# EAGLE design power_converter (EAGLE 6.4)
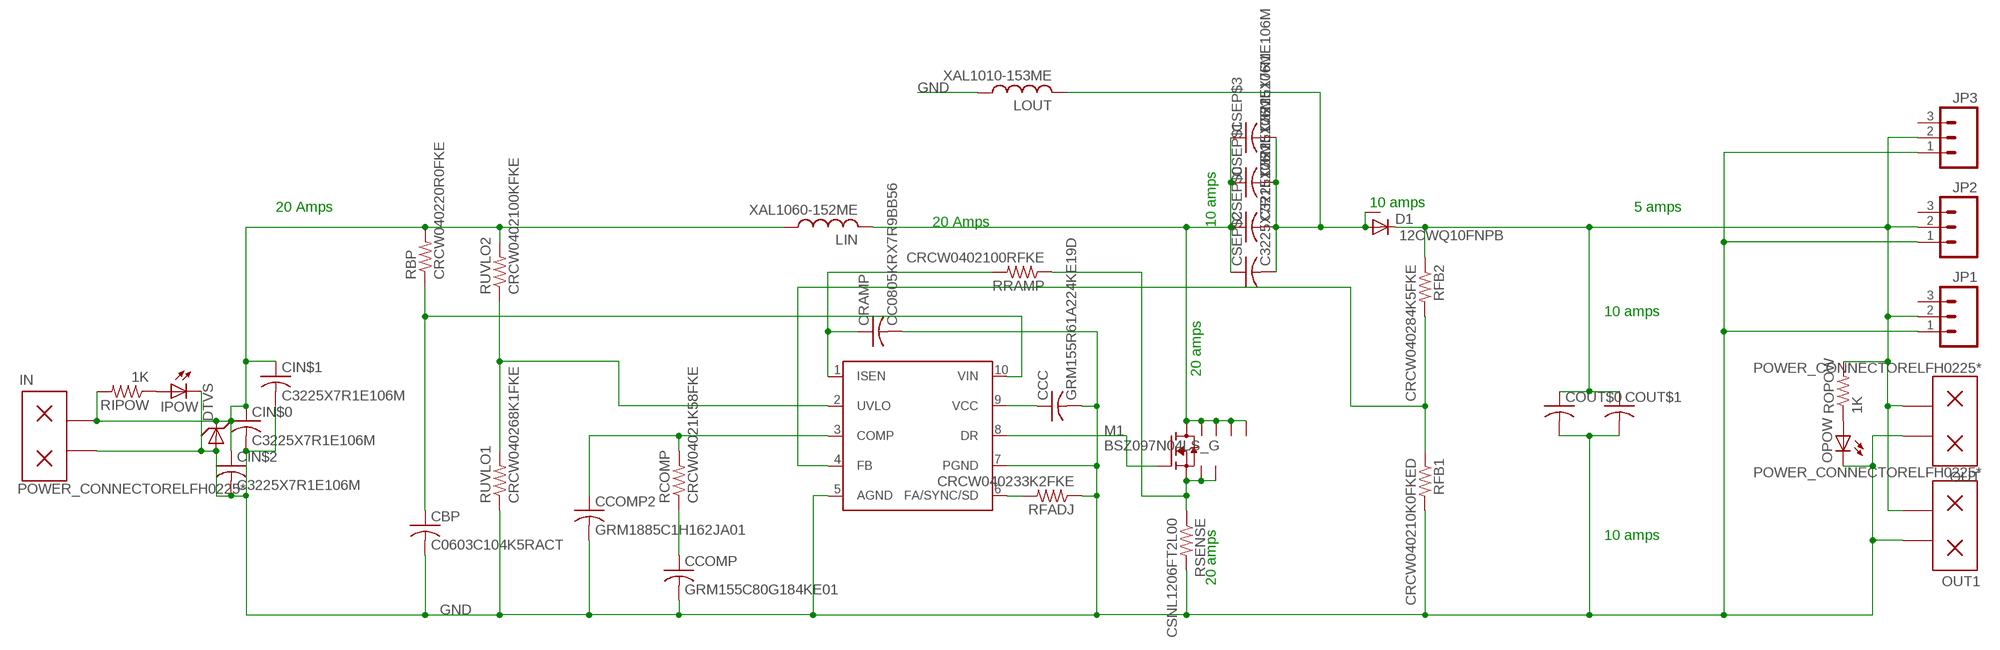
[diagram p0: schematic, sheet 1]

## Parts
CBP  C0603C104K5RACT  C-USC0603  [C0603]
CCC  GRM155R61A224KE19D  C-USC0402  [C0402]
CCOMP  GRM155C80G184KE01  C-USC0402  [C0402]
CCOMP2  GRM1885C1H162JA01  C-USC0603  [C0603]
CIN$0  C3225X7R1E106M  C-USC1210  [C1210]
CIN$1  C3225X7R1E106M  C-USC1210  [C1210]
CIN$2  C3225X7R1E106M  C-USC1210  [C1210]
COUT$0  C-USRR71C331MDN1  [RR71C331MDN1]
COUT$1  C-USRR71C331MDN1  [RR71C331MDN1]
CRAMP  CC0805KRX7R9BB56  C-USC0805  [C0805]
CSEP$0  C3225X7R1E106M  C-USC1210  [C1210]
CSEP$1  C3225X7R1E106M  C-USC1210  [C1210]
CSEP$2  C3225X7R1E106M  C-USC1210  [C1210]
CSEP$3  C3225X7R1E106M  C-USC1210  [C1210]
D1  12CWQ10FNPB  VS-12CWQ10FNPBF  [D-PAK]
DTVS  MMSZ5246BT1G  MMSZ5242BT1G  [SOD-123]
IN  POWER_CONNECTORELFH0225*  [ELFH0225*]
IPOW  LEDCHIPLED_0805  [CHIPLED_0805]
JP1  M03PTH  [1X03]
JP2  M03PTH  [1X03]
JP3  M03PTH  [1X03]
LIN  XAL1060-152ME  L-US1060-152  [1060-152]
LOUT  XAL1010-153ME  L-US1010-153  [1010-153]
M1  BSZ097N04LS_G  [PG-TSDSON8]
OPOW  LEDCHIPLED_0805  [CHIPLED_0805]
OUT  POWER_CONNECTORELFH0225*  [ELFH0225*]
OUT1  POWER_CONNECTORELFH0225*  [ELFH0225*]
RBP  CRCW040220R0FKE  R-US_R0402  [R0402]
RCOMP  CRCW04021K58FKE  R-US_R0402  [R0402]
RFADJ  CRCW040233K2FKE  R-US_R0402  [R0402]
RFB1  CRCW040210K0FKED  R-US_R0402  [R0402]
RFB2  CRCW040284K5FKE  R-US_R0402  [R0402]
RIPOW  1K  R-US_R1206  [R1206]
ROPOW  1K  R-US_R1206  [R1206]
RRAMP  CRCW0402100RFKE  R-US_R0402  [R0402]
RSENSE  CSNL1206FT2L00  R-US_M1206  [M1206]
RUVLO1  CRCW040268K1FKE  R-US_R0402  [R0402]
RUVLO2  CRCW0402100KFKE  R-US_R0402  [R0402]
U$1  LM3481  [MSOP10]

## Nets
GND: CBP.2 CCC.2 CCOMP2.2 CCOMP.2 CIN$0.2 CIN$1.2 CIN$2.2 COUT$0.- COUT$1.- CRAMP.2 DTVS.ANODE(A) IN.P$1 IPOW.C JP1.1 JP2.1 JP3.1 LOUT.P$1 OPOW.C OUT1.P$2 OUT.P$2 RFADJ.1 RFB1.2 RSENSE.2 RUVLO1.1 U$1.5(AGND) U$1.7(PGND)
N$1: CBP.1 RBP.1 U$1.10(VIN)
N$2: CIN$0.1 CIN$1.1 CIN$2.1 DTVS.CATHODE(C) IN.P$2 LIN.P$1 RBP.2 RIPOW.2 RUVLO2.2
N$3: CCC.1 U$1.9(VCC)
N$4: RUVLO1.2 RUVLO2.1 U$1.2(UVLO)
N$5: CCOMP2.1 RCOMP.2 U$1.3(COMP)
N$7: CCOMP.1 RCOMP.1
N$8: CRAMP.1 RRAMP.2 U$1.1(ISEN)
N$9: RFADJ.2 U$1.6(FA/SYNC/SD)
N$10: M1.S$0(S) M1.S$1 M1.S$2 RRAMP.1 RSENSE.1
N$11: M1.G U$1.8(DR)
N$12: CSEP$0.2 CSEP$1.2 CSEP$2.2 CSEP$3.2 D1.ANODE$0(A) D1.ANODE$1(A1) LOUT.P$2
N$13: CSEP$0.1 CSEP$1.1 CSEP$2.1 CSEP$3.1 LIN.P$2 M1.D$0(D) M1.D$1 M1.D$2 M1.D$3 M1.D$4
N$14: COUT$0.+ COUT$1.+ D1.CATHODE(C) JP1.2 JP2.2 JP3.2 OUT1.P$1 OUT.P$1 RFB2.1 ROPOW.2
N$15: RFB1.1 RFB2.2 U$1.4(FB)
N$16: IPOW.A RIPOW.1
N$17: OPOW.A ROPOW.1
Unconnected: JP1.3 JP2.3 JP3.3

## Notes on the sheet
- 10 amps
- 20 Amps | 5 amps
- 20 Amps | 10 amps
- 10 amps
- 20 amps
- 10 amps
- 20 amps

## Library data of the parts
CBP CCC CCOMP CCOMP2 CIN$0 CIN$1 CIN$2 CRAMP CSEP$0 CSEP$1-CSEP$3 = resistor:C-US: CAPACITOR, American symbol
COUT$0 COUT$1 = custom_parts:C-US: CAPACITOR, American symbol
D1 = custom_parts:VS-12CWQ10FNPBF: Schottky Rectifier, 2 x 6 A (diode) datasheet at http://www.vishay.com/docs/94135/12cwq10f.pdf
DTVS = custom_parts:MMSZ5242BT1G: zener diode datasheet at http://www.onsemi.com/pub_link/Collateral/MMSZ5221BT1-D.PDF
IN OUT OUT1 = custom_parts:POWER_CONNECTOR: MOLEX 39543-0202 Terminal Block
IPOW OPOW = led:LED: LED OSRAM: - CHIPLED LG R971, LG N971, LY N971, LG Q971, LY Q971, LO R971, LY R971 LH N974, LH R974 LS Q976, LO Q976, LY Q976 LO Q996 - Hyper CHIPLED LW Q18S LB Q993, LB Q99A, LB R99A - SideLED LS A670, LO A670, LY A670, LG A670, LP A670 LB A673, LV A673, LT A673, LW A673 LH A674 LY A675 LS A676, LA A676, LO A676, LY A676, LW A676 LS A679, LY A679, LG A679 - Hyper Micro SIDELED® LS Y876, LA Y876, LO Y876, LY Y876 LT Y87S - SmartLED LW L88C, LW L88S LB L89C, LB L89S, LG L890 LS L89K, LO L89K, LY L89K LS L896, LA L896, LO L896, LY L896 - TOPLED LS T670, LO T670, LY T670, LG T670, LP T670 LSG T670, LSP T670, LSY T670, LOP T670, LYG T670 LG T671, LOG T671, LSG T671 LB T673, LV T673, LT T673, LW T673 LH T674 LS T676, LA T676, LO T676, LY T676, LB T676, LH T676, LSB T676, LW T676 LB T67C, LV T67C, LT T67C, LS T67K, LO T67K, LY T67K, LW E67C LS E67B, LA E67B, LO E67B, LY E67B, LB E67C, LV E67C, LT E67C LW T67C LS T679, LY T679, LG T679 LS T770, LO T770, LY T770, LG T770, LP T770 LB T773, LV T773, LT T773, LW T773 LH T774 LS E675, LA E675, LY E675, LS T675 LS T776, LA T776, LO T776, LY T776, LB T776 LHGB T686 LT T68C, LB T68C - Hyper Mini TOPLED® LB M676 - Mini TOPLED Santana® LG M470 LS M47K, LO M47K, LY M47K Source: http://www.osram.convergy.de LUXEON: - LUMILED® LXK2-PW12-R00, LXK2-PW12-S00, LXK2-PW14-U00, LXK2-PW14-V00 LXK2-PM12-R00, LXK2-PM12-S00, LXK2-PM14-U00 LXK2-PE12-Q00, LXK2-PE12-R00, LXK2-PE12-S00, LXK2-PE14-T00, LXK2-PE14-U00 LXK2-PB12-K00, LXK2-PB12-L00, LXK2-PB12-M00, LXK2-PB14-N00, LXK2-PB14-P00, LXK2-PB14-Q00 LXK2-PR12-L00, LXK2-PR12-M00, LXK2-PR14-Q00, LXK2-PR14-R00 LXK2-PD12-Q00, LXK2-PD12-R00, LXK2-PD12-S00 LXK2-PH12-R00, LXK2-PH12-S00 LXK2-PL12-P00, LXK2-PL12-Q00, LXK2-PL12-R00 Source: www.luxeon.com KINGBRIGHT: KA-3528ASYC Source: www.kingbright.com
JP1-JP3 = SparkFun-Connectors:M03: Header 3 Standard 3-pin 0.1" header. Use with straight break away headers (SKU : PRT-00116), right angle break away headers (PRT-00553), swiss pins (PRT-00743), machine pins (PRT-00117), and female headers (PRT-00115). Molex polarized connector foot print use with SKU : PRT-08232 with associated crimp pins and housings.
LIN LOUT = custom_parts:L-US: INDUCTOR, American symbol
M1 = custom_parts:BSZ097N04LS_G: mosfet datasheet at http://www.infineon.com/dgdl/BSZ097N04LSG_rev2.0.pdf?folderId=db3a3043163797a6011643468e7505a4&fileId=db3a3043163797a6011643be1d53068c
RBP RCOMP RFADJ RFB1 RFB2 RIPOW ROPOW RRAMP RSENSE RUVLO1 RUVLO2 = resistor:R-US_: RESISTOR, American symbol
U$1 = custom_parts:LM3481: switching regulator controller data sheet at http://www.national.com/ds/LM/LM3481.pdf

## Board
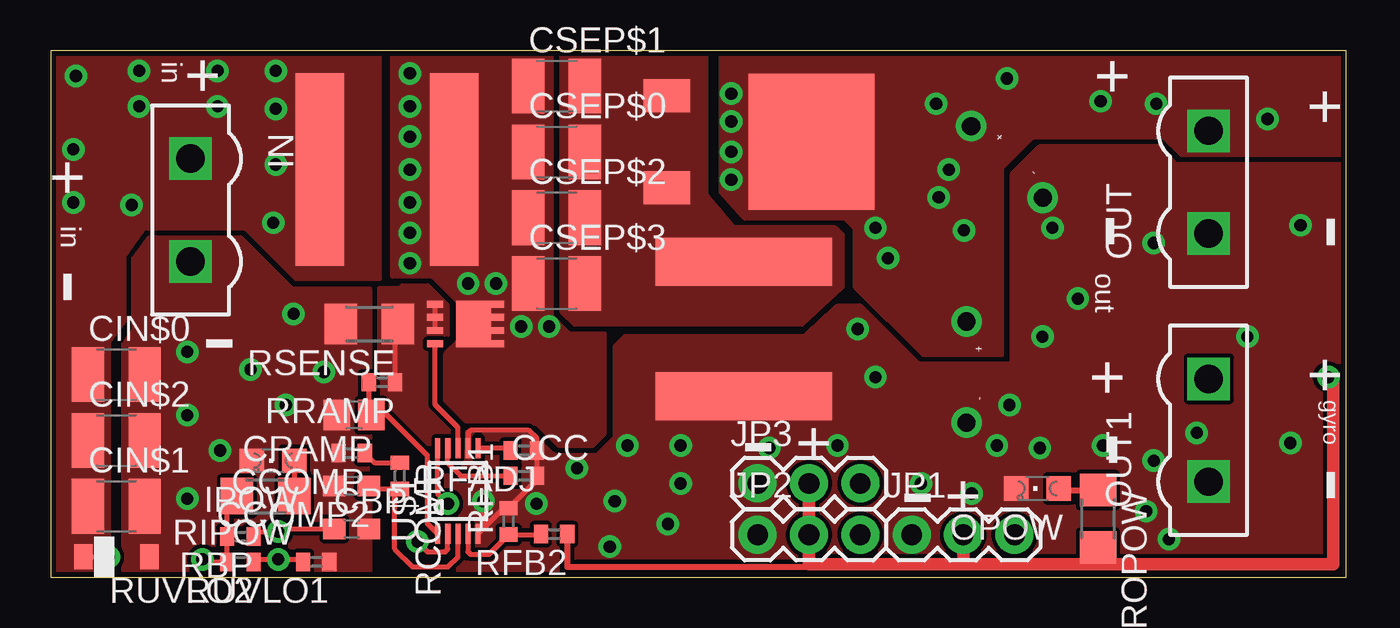
[diagram p1: board, top side]
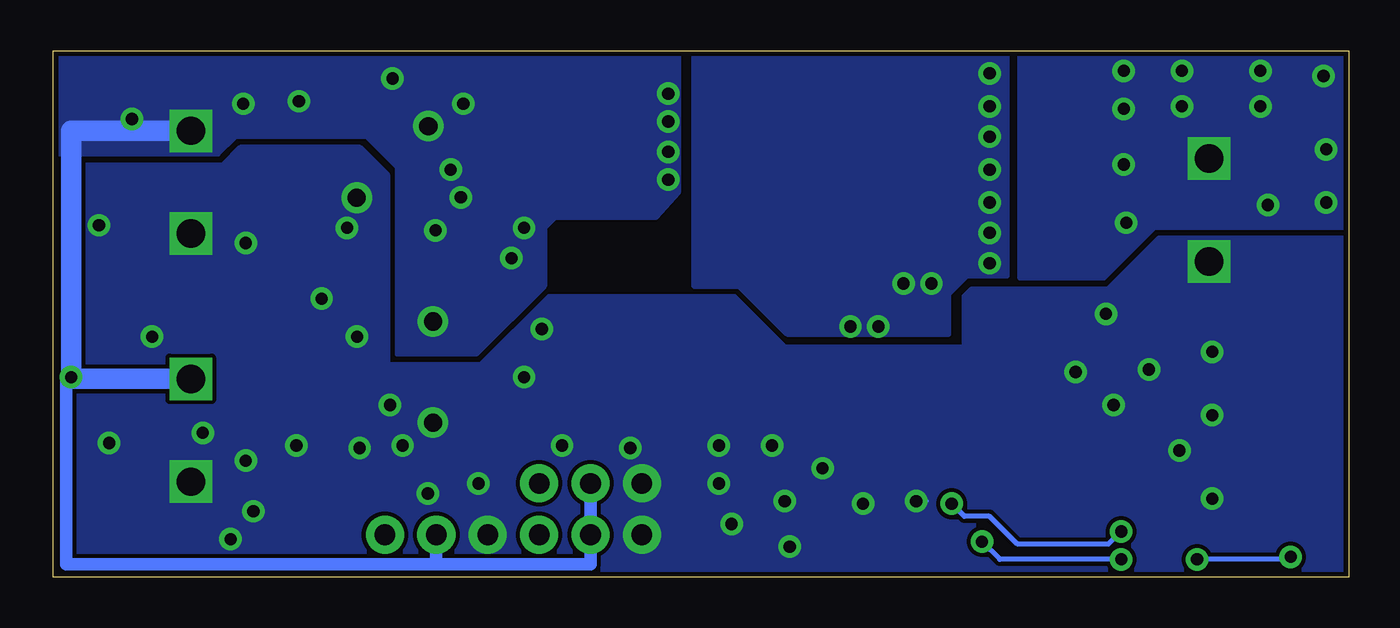
[diagram p2: board, bottom side, seen from below]

Size 64 x 26 mm. Coordinates in mm from the lower left corner, seen from the top.
Outline: 0,0 64,0 64,26 0,26 0,0
Copper layers (1*16): Top 0.035mm / dielectric 1.5mm / Bottom 0.035mm
Design rules "SparkFun": minimum track width 8mil, minimum drill 20mil, track to track 8mil, track to pad 8mil, pad to pad 8mil, via to via 8mil, smd to smd 8mil, copper to edge 10mil, drill to drill 8mil, minimum pad ring 12mil, minimum via ring 10mil, stop-mask expansion 4mil, vias tented up to drill 25mil, thermal gap 10mil

### Footprints (pad centres in the part's own frame; a part is rotated, then mirrored left to right if it is on the bottom)
C0603 = smd 1.1 x 1: 1 -0.85,0; 2 0.85,0
C0402 = smd 0.7 x 0.9: 1 -0.65,0; 2 0.65,0
C1210 = smd 1.6 x 2.7: 1 -1.4,0; 2 1.4,0
RR71C331MDN1 = drill 0.9: + -2.5,0; - 2.5,0
C0805 = smd 1.3 x 1.5: 1 -0.85,0; 2 0.85,0
D-PAK = smd 1.624 x 2.28: ANODE$0 -2.28,-4.56; ANODE$1 2.28,-4.56 | smd 6.74 x 6.23: CATHODE 0,2.585
SOD-123 = smd 0.91 x 1.22: ANODE -1.635,0; CATHODE 1.635,0
ELFH0225* = drill 1.4 square: P$1 2.54,2.54; P$2 -2.54,2.54
CHIPLED_0805 = smd 1.2 x 1.2: A 0,-1.05; C 0,1.05
1X03 = drill 1.016 pad 1.88: 1 0,0; 2 2.54,0; 3 5.08,0
1060-152 = smd 2.39 x 9.5: P$1 -3.325,0; P$2 3.325,0
1010-153 = smd 2.38 x 8.71: P$1 -3.325,0; P$2 3.325,0
PG-TSDSON8 = smd 2.29 x 1.71: D$0 0,0.395 | smd 0.34 x 1.3: D$1 -0.975,1.25; D$2 -0.325,1.25; D$3 0.325,1.25; D$4 0.975,1.25 | smd 0.34 x 0.8: G 0.975,-1.5; S$0 -0.975,-1.5; S$1 -0.325,-1.5; S$2 0.325,-1.5
R0402 = smd 0.7 x 0.9: 1 -0.65,0; 2 0.65,0
R1206 = smd 1.6 x 1.803: 1 -1.422,0; 2 1.422,0
M1206 = smd 1.6 x 2: 1 -1.4,0; 2 1.4,0
MSOP10 = smd 0.25 x 1: 1 -1,-2.113; 2 -0.5,-2.113; 3 0,-2.113; 4 0.5,-2.113; 5 1,-2.113; 6 1,2.113; 7 0.5,2.113; 8 0,2.113; 9 -0.5,2.113; 10 -1,2.113

### Placement (x,y rotation side)
CBP  14.88,2.38 0 top
CCC  23.38,5 0 top
CCOMP  14.88,6.12 180 top
CCOMP2  14.88,4.5 180 top
CIN$0  3.25,10 0 top
CIN$1  3.25,3.5 0 top
CIN$2  3.25,6.75 0 top
COUT$0  45.25,10.12 270 top
COUT$1  47.25,20.5 315 top
CRAMP  15,8 180 top
CSEP$0  25,21 0 top
CSEP$1  25,24.25 0 top
CSEP$2  25,17.75 0 top
CSEP$3  25,14.5 0 top
D1  35,21.5 270 top
DTVS  3.25,1 180 top
IN  4.38,18.12 270 top
IPOW  11,5.75 90 top
JP1  42.55,2.09 0 top
JP2  34.92,2.09 0 top
JP3  34.92,4.63 0 top
LIN  16.62,20.12 0 top
LOUT  34.25,12.25 90 top
M1  20.5,12.5 270 top
OPOW  48.75,4.38 90 top
OUT  59.75,19.5 90 top
OUT1  59.75,7.25 90 top
RBP  9.38,2 180 top
RCOMP  17.25,5 270 top
RFADJ  23.38,6.25 180 top
RFB1  22.62,2.75 90 top
RFB2  24.88,2.12 180 top
RIPOW  10.62,4 180 top
ROPOW  51.75,2.88 270 top
RRAMP  16.38,9.62 180 top
RSENSE  15.75,12.5 180 top
RUVLO1  13.12,0.75 180 top
RUVLO2  9.38,0.75 180 top
U$1  20.12,4.25 0 top

### Tracks (layer width: path | path; a pad name or v marks a point on that pad's centre or on a via)
GND  (via drill 0.6)
  Top 0.254: 21.38,2.39 22.39,3.4 RFB1.2 24.02,4.8 CCC.2 RFADJ.1 24.02,6.85 23.62,7.25 20.75,7.25 20.62,7.12 U$1.7 | U$1.5 21.38,2.39 | 21.38,2.39 v21.38,3.75
  Bottom 0.254: v21.38,3.75 20.88,3.75
  other vias: 31.12,4.62 54.5,5.75 54.12,3.25 55.25,1.88 48.88,6.38 43,4.62 38.88,6.5 30.5,2.62 27.62,1.5 24,3.62 26,5.38 28.5,6.5 27.88,3.75 31.12,6.5 35.5,6.38 45.5,4.12 39.88,12.25 40.75,9.88 49,11.88 47.38,8.5 46.75,6.5 52,6.5 56.62,7.12 61.25,6.62 59.12,11.88 50.75,13.75 49.5,17.25 54.5,16.5 61.75,17.38 6.75,11.12 6.75,8 6.75,3.88 8.38,6.25 11.62,8.5 13.5,10.12 12,13 9.88,10.25
  pour Top (no thermals): 63.88,20.38 55.62,20.38 54.75,21.25 48.88,21.25 47.5,19.88 47.5,10.5 42.88,10.5 40,13.38 38.88,13.38 37.25,11.88 28.38,11.88 27.88,11.38 27.88,6.88 27,6 24.88,6 23.62,7.12 20.5,7.12 20.5,5.5 19,5.5 16.88,7 16.88,0 63.88,0
  pour Top (no thermals): 3.62,0 3.62,11.5 4.12,12.25 4.12,15.75 4.88,16.75 9.38,16.75 11.88,14.25 15.75,14.25 15.75,0
  pour Bottom (no thermals): 0,16.75 0,0 63.88,0 63.88,20.38 55.62,20.38 54.75,21.25 48.88,21.25 47.5,19.88 47.5,10.5 42.88,10.5 39.5,13.88 30.38,13.88 27.88,11.38 19,11.38 19,13.88 18.62,14.25 11.88,14.25 9.38,16.75
N$1  (via drill 0.6)
  Top 0.254: CBP.1 11.38,2.38 v11.25,2.25 10.28,2.25 RBP.1 | U$1.10 19.12,4.12 v19.62,3.62
  Bottom 0.254: v11.25,2.25 11.88,1.62 16.38,1.62 17.75,3 19,3 v19.62,3.62
N$2  (via drill 0.6)
  Top 0.254: DTVS.CATHODE v2.88,1 | v7.5,0.88 7.62,0.75 RUVLO2.2 RBP.2 8.72,3.52 RIPOW.2
  Bottom 0.254: v2.88,1 3,0.88 v7.5,0.88
  other vias: 1.25,24.75 1.12,21.12 1.12,18.5 4,18.38 11,17.5 11.12,20.38 11.12,23.12 8.25,23.25 4.38,23.25 4.38,25 8.25,25 11.12,25
  pour Top (no thermals): 4.62,17.25 9.62,17.25 12.12,14.75 16.25,14.75 16.25,26 0,26 0,0 2.88,0 2.88,11.62 3.62,12.62 3.62,15.88
  pour Bottom (no thermals): 0,26 0,17.25 9.62,17.25 12.12,14.75 16.25,14.75 16.25,26
N$3
  Top 0.254: U$1.9 19.62,5.62 20.25,5 CCC.1
N$4  (via drill 0.6)
  Top 0.254: U$1.2 19.62,1.38 19.5,1.25 18.62,1.25 v18.12,1.75 | RUVLO2.1 10.15,0.88 v11.25,0.88 12.35,0.88 RUVLO1.2
  Bottom 0.254: v18.12,1.75 17.25,0.88 v11.25,0.88
N$5
  Top 0.254: U$1.3 20.12,1 19.62,0.5 17.88,0.5 17,1.38 17,4.1 RCOMP.2 15.88,4.35 CCOMP2.1
N$7
  Top 0.254: CCOMP.1 16,5.65 RCOMP.1
N$8
  Top 0.254: U$1.1 18.62,2.64 18.62,6 16.62,8 CRAMP.1 15.72,8.12 RRAMP.2
N$9
  Top 0.254: RFADJ.2 22.61,6.36 U$1.6
N$10
  Top 0.254: M1.S$0 M1.S$1 M1.S$2 | RRAMP.1 17.02,12.38 RSENSE.1
  pour Top (no thermals): 19.62,13.38 18.62,14.38 17.38,14.38 17.25,14.25 16.25,14.25 16.25,9 18.75,6.5 20,6.5 20,7.5 19,8.5 19,11.38 19.62,12
N$11
  Top 0.254: U$1.8 20.12,7.38 19,8.5 M1.G
N$12
  pour Top (no thermals): 25.25,26 25.25,13.12 25.88,12.5 37.12,12.5 39.12,14.38 39.12,16.88 38.75,17.25 33.75,17.25 32.38,18.88 32.38,26
N$13  (via drill 0.6)
  other vias: 23.25,12.38 24.62,12.38 22,14.5 20.62,14.5 17.75,15.5 17.75,17 17.75,18.5 17.75,20.12 17.75,21.75 17.75,23.25 17.75,24.88
  pour Top (no thermals): 16.88,26 16.88,14.88 18.88,14.88 20.12,13.62 20.12,11.62 19.5,11 19.5,8.75 20.62,7.62 24,7.62 25.12,6.5 26.75,6.5 27.38,7.12 27.38,12 25.62,12 24.75,12.88 24.75,26
  pour Bottom (no thermals): 27.75,12 19.75,12 19.75,14 18.88,14.88 16.88,14.88 16.88,26 32.38,26 32.38,14.38 30.12,14.38
N$14  (via drill 0.6)
  Top 0.305: ROPOW.2 51.75,0.62 | 63.38,9.88 v63.12,9.88 | RFB2.1 25.52,0.5 37.47,0.5 37.47,0.62
  Top 0.61: 63.38,9.88 63.38,0.62 51.75,0.62 45.09,0.62 | JP3.2 JP2.2 37.47,0.62 45.09,0.62 | JP1.2 45.09,0.62
  Bottom 0.61: 45.09,0.62 63.38,0.62 63.38,9.88 v63.12,9.88 | 45.09,0.62 37.47,0.62 JP3.2 | 45.09,0.62 JP1.2
  Bottom 1.016: OUT.P$1 63.12,22.04 v63.12,9.88 63.12,9.79 OUT1.P$1
  other vias: 54.62,23.38 51.88,23.5 60.12,22.62 44.38,20.12 43.75,23.38 33.62,23.88 33.62,22.5 33.62,21 33.62,19.62 41.38,15.75 45.12,17.12 40.75,17.25 43.88,18.75 47.25,24.62
  pour Top (no thermals): 33.12,26 33.12,19 34.25,17.75 39.25,17.75 39.75,17.25 39.75,14.38 43.12,11 47,11 47,20.25 48.5,21.75 55,21.75 55.88,20.88 63.88,20.88 63.88,26
  pour Bottom (no thermals): 63.88,26 33.12,26 33.12,19 34.25,17.75 39.25,17.75 39.75,17.25 39.75,14.38 43.12,11 47,11 47,20.25 48.5,21.75 55,21.75 55.88,20.88 63.88,20.88
N$15
  Top 0.254: U$1.4 20.62,1.25 20.75,1.12 21.65,1.12 RFB1.1 24.2,2.1 RFB2.2
N$16
  Top 0.254: IPOW.A RIPOW.1
N$17
  Top 0.305: 51.75,4.25 ROPOW.1 49.8,4.3 OPOW.A

### Text on the board
tPlace: in | + | + | + | + | - | in | - | out | - | - | + | + | gyro | - | + | - | - | + | -